# EAGLE design converter (EAGLE 7.2.0)
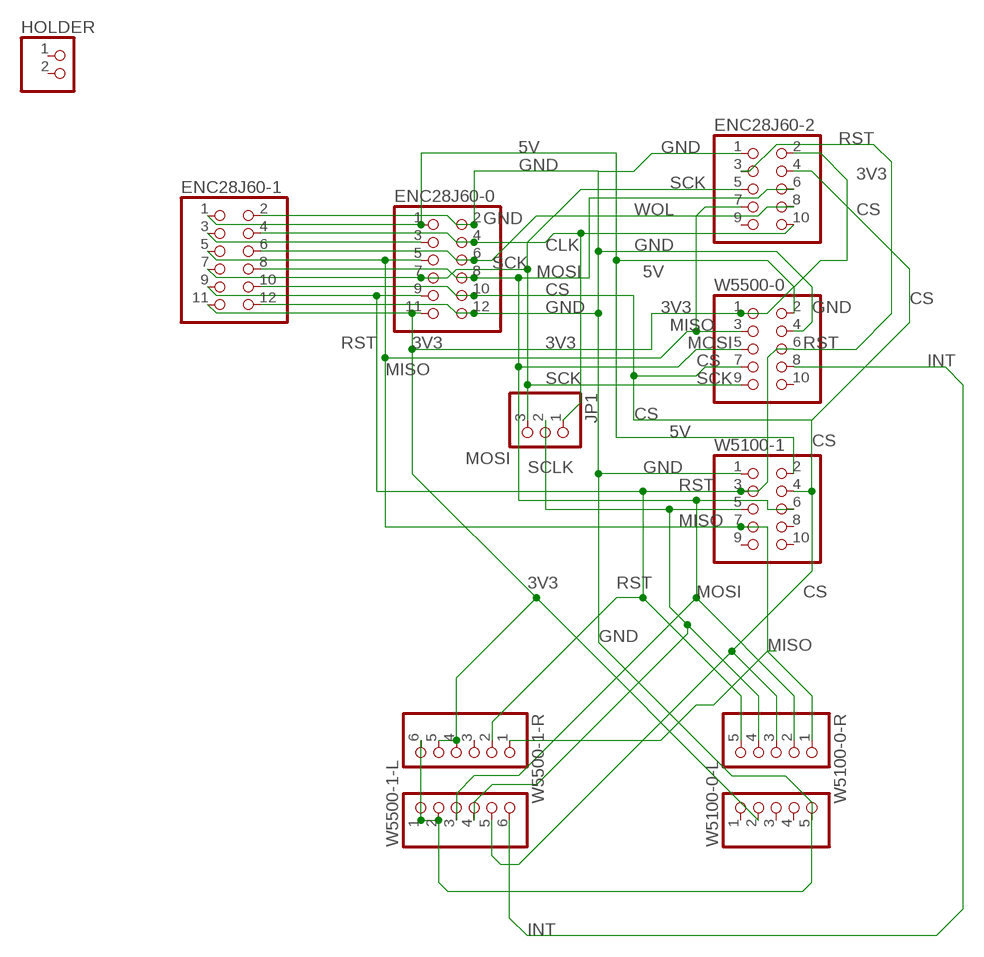
[diagram p0: schematic, sheet 1]

## Parts
ENC28J60-0  PINHD-2X6  [2X06]
ENC28J60-1  PINHD-2X6  [2X06]
ENC28J60-2  PINHD-2X5  [2X05]
HOLDER  PINHD-1X2  [1X02]
JP1  PINHD-1X3  [1X03]
W5100-0-L  PINHD-1X5  [1X05]
W5100-0-R  PINHD-1X5  [1X05]
W5100-1  PINHD-2X5  [2X05]
W5500-0  PINHD-2X5  [2X05]
W5500-1-L  PINHD-1X6  [1X06]
W5500-1-R  PINHD-1X6  [1X06]

## Nets
3V3: ENC28J60-0.11 ENC28J60-1.11 ENC28J60-2.2 W5100-0-L.2 W5500-0.1 W5500-1-R.4 W5500-1-R.5
5V: ENC28J60-0.1 ENC28J60-1.1 W5100-1.2 W5500-0.2
CLK: ENC28J60-0.4 ENC28J60-1.4 ENC28J60-2.10 JP1.1
CS: ENC28J60-0.10 ENC28J60-1.10 ENC28J60-2.4 W5100-0-R.3 W5100-1.4 W5500-0.7 W5500-1-L.5
GND: ENC28J60-0.2 ENC28J60-0.12 ENC28J60-1.2 ENC28J60-1.12 ENC28J60-2.1 W5100-0-L.5 W5100-1.1 W5500-0.4 W5500-1-L.1 W5500-1-L.2 W5500-1-R.6
INT: W5500-0.8 W5500-1-L.6
MISO: ENC28J60-0.5 ENC28J60-1.5 ENC28J60-2.7 W5100-0-R.1 W5100-1.7 W5500-0.3
MOSI: ENC28J60-0.8 ENC28J60-1.8 ENC28J60-2.6 W5100-0-R.2 W5100-1.6 W5500-0.5 W5500-1-L.3
N$2: W5500-1-R.1
N$3: ENC28J60-0.3 ENC28J60-1.3
RST: ENC28J60-0.9 ENC28J60-1.9 ENC28J60-2.3 W5100-0-R.5 W5100-1.3 W5500-0.6 W5500-1-R.2
SCK: ENC28J60-0.7 ENC28J60-1.7 ENC28J60-2.5 JP1.3 W5500-0.9
SCLK: JP1.2 W5100-0-R.4 W5100-1.5 W5500-1-L.4
WOL: ENC28J60-0.6 ENC28J60-1.6 ENC28J60-2.8
Unconnected: ENC28J60-2.9 HOLDER.1 HOLDER.2 W5100-0-L.1 W5100-0-L.3 W5100-0-L.4 W5100-1.8 W5100-1.9 W5100-1.10 W5500-0.10 W5500-1-R.3

## Library data of the parts
ENC28J60-0 ENC28J60-1 = pinhead:PINHD-2X6: PIN HEADER
ENC28J60-2 W5100-1 W5500-0 = pinhead:PINHD-2X5: PIN HEADER
HOLDER = pinhead:PINHD-1X2: PIN HEADER
JP1 = pinhead:PINHD-1X3: PIN HEADER
W5100-0-L W5100-0-R = pinhead:PINHD-1X5: PIN HEADER
W5500-1-L W5500-1-R = pinhead:PINHD-1X6: PIN HEADER

## Board
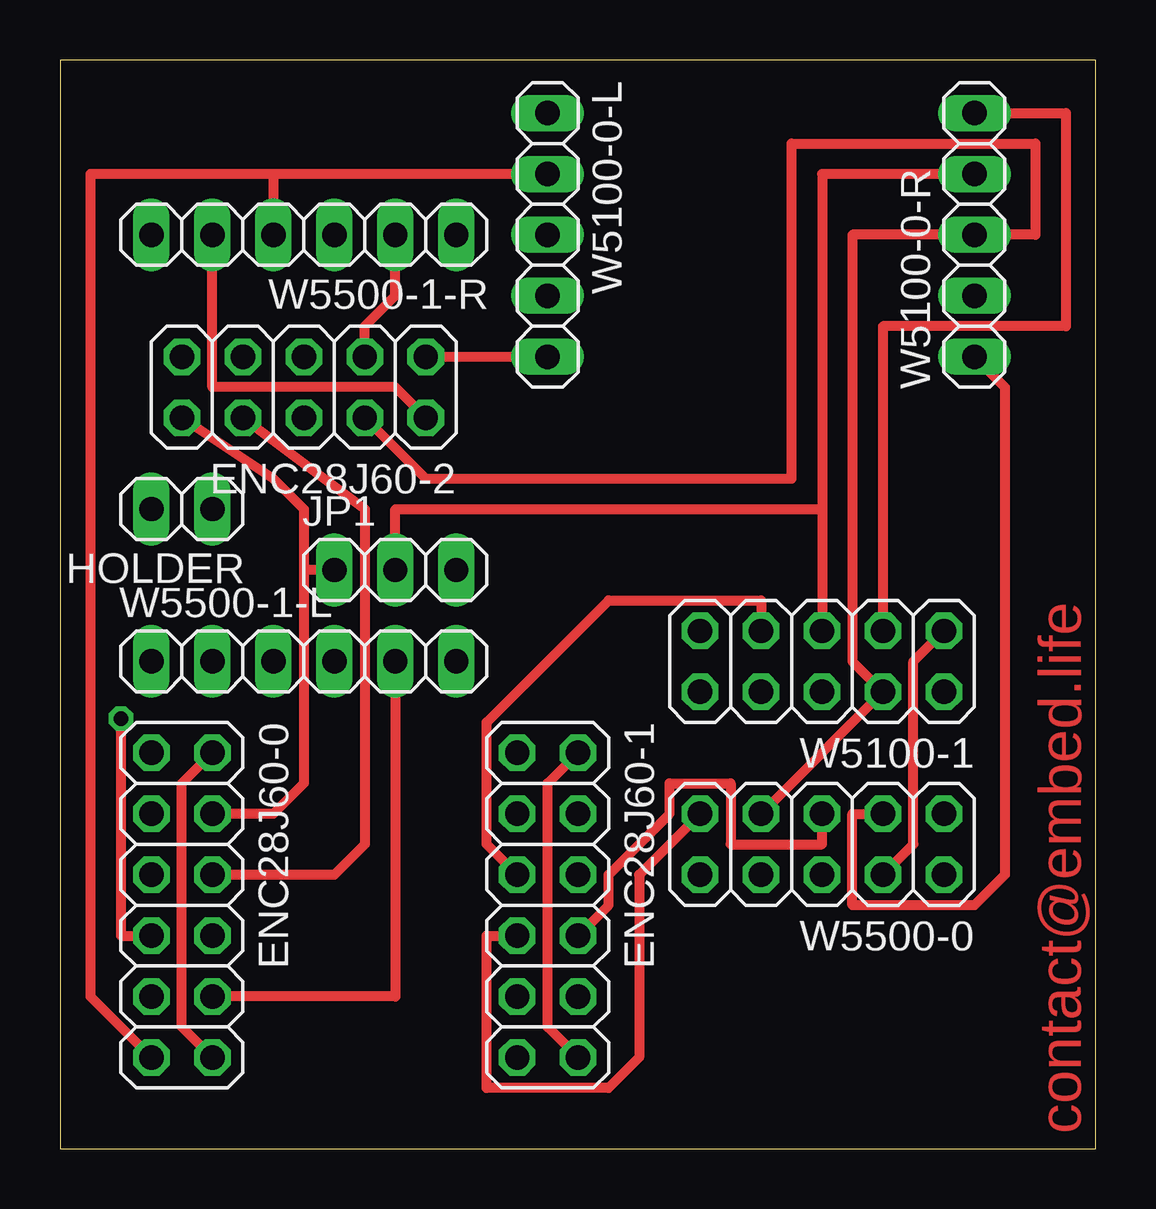
[diagram p1: board, top side]
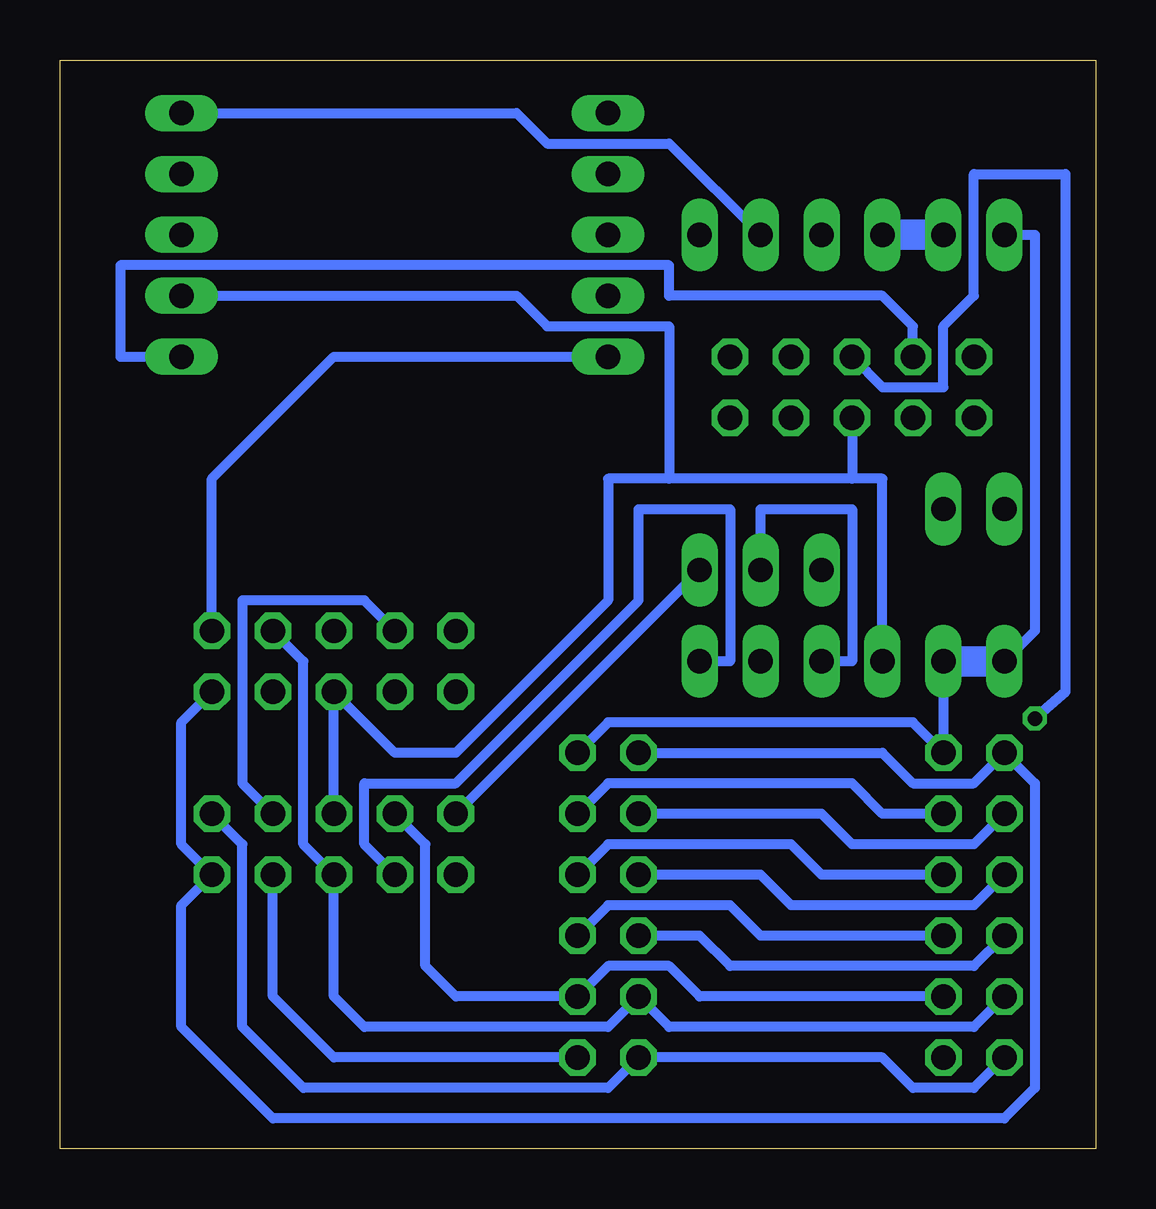
[diagram p2: board, bottom side, seen from below]

Size 43.16 x 45.39 mm. Coordinates in mm from the lower left corner, seen from the top.
Outline: 0,0 43.16,0 43.16,45.39 0,45.39 0,0
Copper layers (1*16): Top 0.035mm / dielectric 1.5mm / Bottom 0.035mm
Design rules "default": minimum track width 10mil, minimum drill 24mil, track to track 8mil, track to pad 8mil, pad to pad 8mil, via to via 8mil, smd to smd 8mil, copper to edge 40mil, drill to drill 8mil, minimum pad ring 10mil, minimum via ring 8mil, stop-mask expansion 4mil, vias tented up to drill 0mil, thermal gap 10mil

### Footprints (pad centres in the part's own frame; a part is rotated, then mirrored left to right if it is on the bottom)
2X06 = drill 1.016 octagon: 1 -6.35,-1.27; 2 -6.35,1.27; 3 -3.81,-1.27; 4 -3.81,1.27; 5 -1.27,-1.27; 6 -1.27,1.27; 7 1.27,-1.27; 8 1.27,1.27; 9 3.81,-1.27; 10 3.81,1.27; 11 6.35,-1.27; 12 6.35,1.27
2X05 = drill 1.016 octagon: 1 -5.08,-1.27; 2 -5.08,1.27; 3 -2.54,-1.27; 4 -2.54,1.27; 5 0,-1.27; 6 0,1.27; 7 2.54,-1.27; 8 2.54,1.27; 9 5.08,-1.27; 10 5.08,1.27
1X02 = drill 1.016 long: 1 -1.27,0; 2 1.27,0
1X03 = drill 1.016 long: 1 -2.54,0; 2 0,0; 3 2.54,0
1X05 = drill 1.016 long: 1 -5.08,0; 2 -2.54,0; 3 0,0; 4 2.54,0; 5 5.08,0
1X06 = drill 1.016 pad 1.27 long: 1 -6.35,0; 2 -3.81,0; 3 -1.27,0; 4 1.27,0; 5 3.81,0; 6 6.35,0

### Placement (x,y rotation side)
ENC28J60-0  5.08,10.16 270 top
ENC28J60-1  20.32,10.16 270 top
ENC28J60-2  10.16,31.75 180 top
HOLDER  5.08,26.67 180 top
JP1  13.97,24.13 0 top
W5100-0-L  20.32,38.1 270 top
W5100-0-R  38.1,38.1 90 top
W5100-1  31.75,20.32 180 top
W5500-0  31.75,12.7 180 top
W5500-1-L  10.16,20.32 0 top
W5500-1-R  10.16,38.1 180 top

### Tracks (layer width: path | path; a pad name or v marks a point on that pad's centre or on a via)
3V3  (via drill 0.6)
  Top 0.406: 8.89,40.64 1.27,40.64 1.27,6.35 ENC28J60-0.11 | W5100-0-L.2 8.89,40.64 | 8.89,40.64 W5500-1-R.4 | ENC28J60-2.2 13.97,31.75 6.35,31.75 W5500-1-R.5
  Bottom 0.406: ENC28J60-0.11 5.08,2.54 7.62,2.54 8.89,3.81 ENC28J60-1.11 20.32,2.54 33.02,2.54 35.56,5.08 35.56,12.7 W5500-0.1
  Bottom 1.27: W5500-1-R.4 W5500-1-R.5
  other vias: 8.89,38.1
5V
  Bottom 0.406: W5100-1.2 38.1,17.78 38.1,12.7 W5500-0.2 38.1,10.16 38.1,5.08 34.29,1.27 3.81,1.27 2.54,2.54 2.54,15.24 ENC28J60-0.1 5.08,15.24 7.62,15.24 8.89,16.51 ENC28J60-1.1
CLK
  Top 0.406: JP1.1 10.16,24.13 | 10.16,24.13 10.16,15.24 8.89,13.97 ENC28J60-0.4 | ENC28J60-2.10 8.89,27.94 10.16,26.67 10.16,24.13
  Bottom 0.406: ENC28J60-0.4 8.89,13.97 10.16,15.24 20.32,15.24 ENC28J60-1.4
CS
  Top 0.406: W5500-0.7 W5100-1.4 33.02,20.32 33.02,38.1 W5100-0-R.3 40.64,38.1 40.64,41.91 30.48,41.91 30.48,27.94 15.24,27.94 ENC28J60-2.4 | W5500-1-L.5 13.97,6.35 ENC28J60-0.10
  Bottom 0.406: ENC28J60-0.10 16.51,6.35 17.78,7.62 20.32,7.62 ENC28J60-1.10 26.67,6.35 27.94,7.62 27.94,12.7 W5500-0.7
GND
  Top 0.406: ENC28J60-0.12 5.08,5.08 5.08,15.24 ENC28J60-0.2 | ENC28J60-1.12 20.32,5.08 20.32,15.24 ENC28J60-1.2 | W5500-0.4 35.56,12.7 35.56,20.32 W5100-1.1 | ENC28J60-2.1 W5100-0-L.5
  Bottom 0.406: ENC28J60-1.2 20.32,17.78 7.62,17.78 ENC28J60-0.2 W5500-1-L.2 | ENC28J60-1.12 31.75,3.81 34.29,6.35 W5500-0.4 | W5100-1.1 36.83,27.94 31.75,33.02 W5100-0-L.5 | W5500-1-R.6 2.54,38.1 2.54,21.59 W5500-1-L.1
  Bottom 1.27: W5500-1-L.1 W5500-1-L.2
INT
  Bottom 0.406: W5500-0.8 30.48,12.7 30.48,15.24 26.67,15.24 19.05,22.86 19.05,26.67 15.24,26.67 15.24,20.32 W5500-1-L.6
MISO
  Top 0.406: ENC28J60-1.5 17.78,12.7 17.78,17.78 22.86,22.86 29.21,22.86 W5100-1.7 | W5100-0-R.1 39.37,31.75 39.37,11.43 38.1,10.16 33.02,10.16 33.02,13.97 W5500-0.3
  Bottom 0.406: ENC28J60-0.5 5.08,10.16 12.7,10.16 13.97,11.43 ENC28J60-1.5 | W5100-1.7 30.48,22.86 35.56,22.86 35.56,15.24 W5500-0.3 | ENC28J60-2.7 7.62,34.29 8.89,35.56 17.78,35.56 17.78,36.83 40.64,36.83 40.64,33.02 W5100-0-R.1
MOSI
  Top 0.406: ENC28J60-1.8 22.86,10.16 22.86,11.43 25.4,13.97 25.4,15.24 27.94,15.24 27.94,12.7 31.75,12.7 W5500-0.5
  Bottom 0.406: ENC28J60-0.8 13.97,8.89 15.24,10.16 20.32,10.16 ENC28J60-1.8 | W5500-0.5 W5100-1.6 29.21,16.51 26.67,16.51 20.32,22.86 20.32,27.94 17.78,27.94 | W5500-1-L.3 8.89,27.94 10.16,27.94 | 10.16,27.94 17.78,27.94 | W5100-0-R.2 24.13,35.56 22.86,34.29 17.78,34.29 17.78,27.94 | ENC28J60-2.6 10.16,27.94
N$3
  Bottom 0.406: ENC28J60-0.3 5.08,12.7 10.16,12.7 11.43,13.97 ENC28J60-1.3
RST
  Top 0.406: W5100-0-R.5 41.91,43.18 41.91,34.29 34.29,34.29 W5100-1.3 | ENC28J60-2.3 12.7,34.29 13.97,35.56 W5500-1-R.2
  Bottom 0.406: ENC28J60-0.9 5.08,5.08 17.78,5.08 ENC28J60-1.9 20.32,5.08 30.48,5.08 31.75,6.35 W5500-0.6 33.02,12.7 33.02,20.32 W5100-1.3 | W5100-0-R.5 24.13,43.18 22.86,41.91 17.78,41.91 W5500-1-R.2
SCK  (via drill 0.6)
  Top 0.406: W5500-0.9 24.13,11.43 24.13,3.81 22.86,2.54 17.78,2.54 17.78,8.89 ENC28J60-1.7 | v2.54,17.94 2.54,8.89 ENC28J60-0.7
  Bottom 0.406: ENC28J60-0.7 5.08,7.62 15.24,7.62 16.51,8.89 ENC28J60-1.7 | W5500-0.9 JP1.3 | ENC28J60-2.5 8.89,31.75 6.35,31.75 6.35,34.29 5.08,35.56 5.08,40.64 1.27,40.64 1.27,19.05 v2.54,17.94
SCLK
  Top 0.406: JP1.2 13.97,26.67 31.75,26.67 | 31.75,26.67 W5100-1.5 | W5100-0-R.4 31.75,40.64 31.75,26.67
  Bottom 0.406: JP1.2 13.97,26.67 10.16,26.67 10.16,20.32 W5500-1-L.4
WOL
  Top 0.406: ENC28J60-2.8 12.7,26.67 12.7,12.7 11.43,11.43 ENC28J60-0.6
  Bottom 0.406: ENC28J60-0.6 11.43,11.43 12.7,12.7 20.32,12.7 ENC28J60-1.6

### Text on the board
Top: contact@embed.life